# EAGLE design Panel (EAGLE 6.5.0)
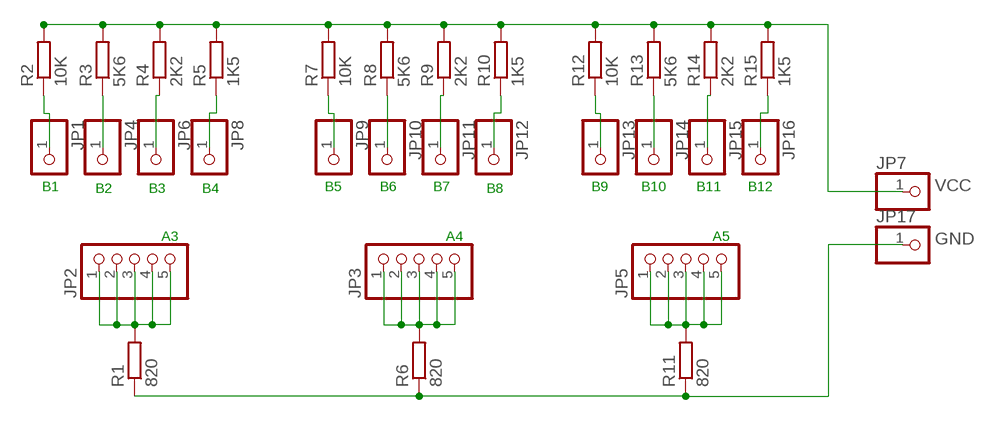
[diagram p0: schematic, sheet 1]

## Parts
JP1  PINHD-1X1  [1X01]
JP2  PINHD-1X5  [1X05]
JP3  PINHD-1X5  [1X05]
JP4  PINHD-1X1  [1X01]
JP5  PINHD-1X5  [1X05]
JP6  PINHD-1X1  [1X01]
JP7  PINHD-1X1  [1X01]
JP8  PINHD-1X1  [1X01]
JP9  PINHD-1X1  [1X01]
JP10  PINHD-1X1  [1X01]
JP11  PINHD-1X1  [1X01]
JP12  PINHD-1X1  [1X01]
JP13  PINHD-1X1  [1X01]
JP14  PINHD-1X1  [1X01]
JP15  PINHD-1X1  [1X01]
JP16  PINHD-1X1  [1X01]
JP17  PINHD-1X1  [1X01]
R1  820  R-EU_0207/12  [0207/12]
R2  10K  R-EU_0207/12  [0207/12]
R3  5K6  R-EU_0207/12  [0207/12]
R4  2K2  R-EU_0207/12  [0207/12]
R5  1K5  R-EU_0207/12  [0207/12]
R6  820  R-EU_0207/12  [0207/12]
R7  10K  R-EU_0207/12  [0207/12]
R8  5K6  R-EU_0207/12  [0207/12]
R9  2K2  R-EU_0207/12  [0207/12]
R10  1K5  R-EU_0207/12  [0207/12]
R11  820  R-EU_0207/12  [0207/12]
R12  10K  R-EU_0207/12  [0207/12]
R13  5K6  R-EU_0207/12  [0207/12]
R14  2K2  R-EU_0207/12  [0207/12]
R15  1K5  R-EU_0207/12  [0207/12]

## Nets
A1: JP3.1 JP3.2 JP3.3 JP3.4 JP3.5 R6.2
A2: JP5.1 JP5.2 JP5.3 JP5.4 JP5.5 R11.2
A3: JP2.1 JP2.2 JP2.3 JP2.4 JP2.5 R1.2
B1: JP1.1 R2.1
B2: JP4.1 R3.1
B3: JP6.1 R4.1
B4: JP8.1 R5.1
B5: JP9.1 R7.1
B6: JP10.1 R8.1
B7: JP11.1 R9.1
B8: JP12.1 R10.1
B9: JP13.1 R12.1
B10: JP14.1 R13.1
B11: JP15.1 R14.1
B12: JP16.1 R15.1
GND: JP17.1 R1.1 R6.1 R11.1
VCC: JP7.1 R2.2 R3.2 R4.2 R5.2 R7.2 R8.2 R9.2 R10.2 R12.2 R13.2 R14.2 R15.2

## Notes on the sheet
- B1 | B2 | B3 | B4 | B5 | B6 | B7 | B8 | B9 | B10 | B11 | B12
- A3 | A4 | A5

## Library data of the parts
JP1 JP4 JP6-JP17 = pinhead:PINHD-1X1: PIN HEADER
JP2 JP3 JP5 = pinhead:PINHD-1X5: PIN HEADER
R1-R15 = resistor:R-EU_: RESISTOR, European symbol

## Net classes
0 default: width 0.254 mm, drill 0.254 mm, clearance 0.305 mm

## Board
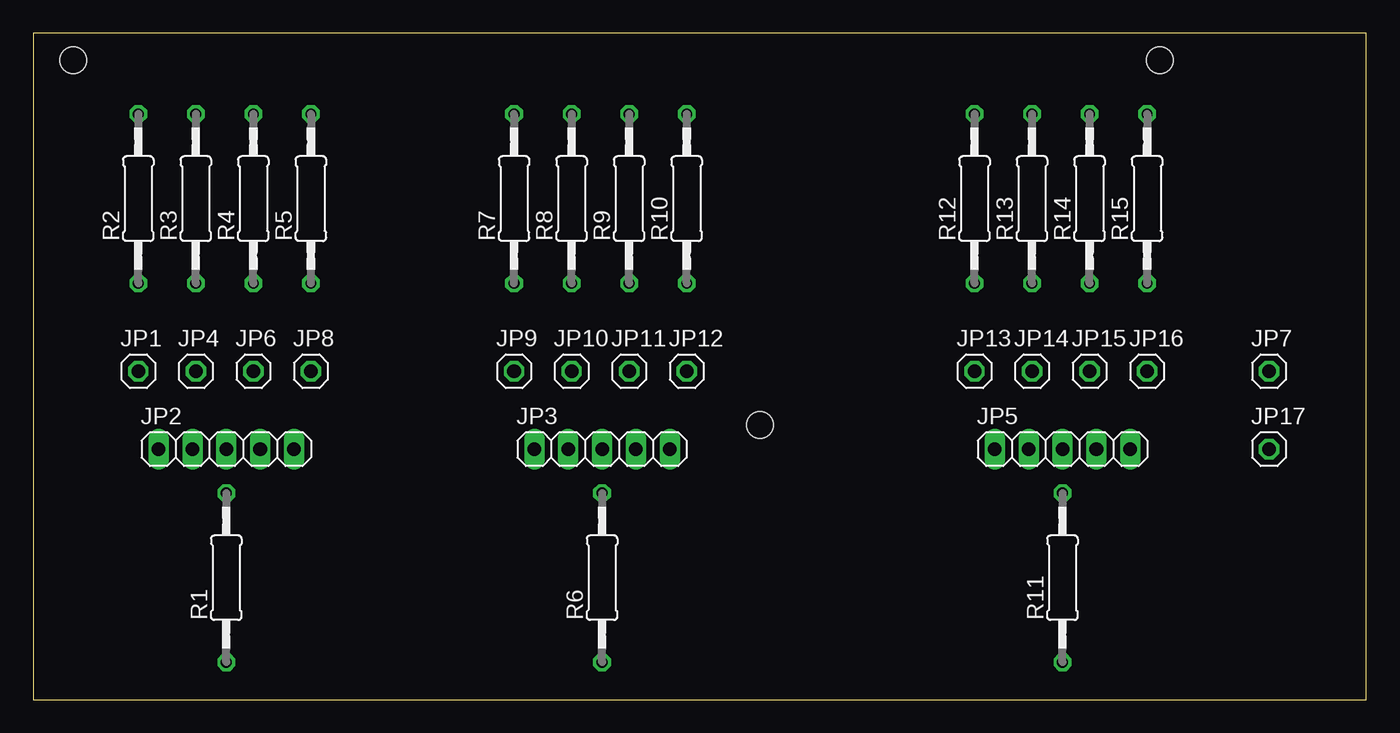
[diagram p1: board, top side]
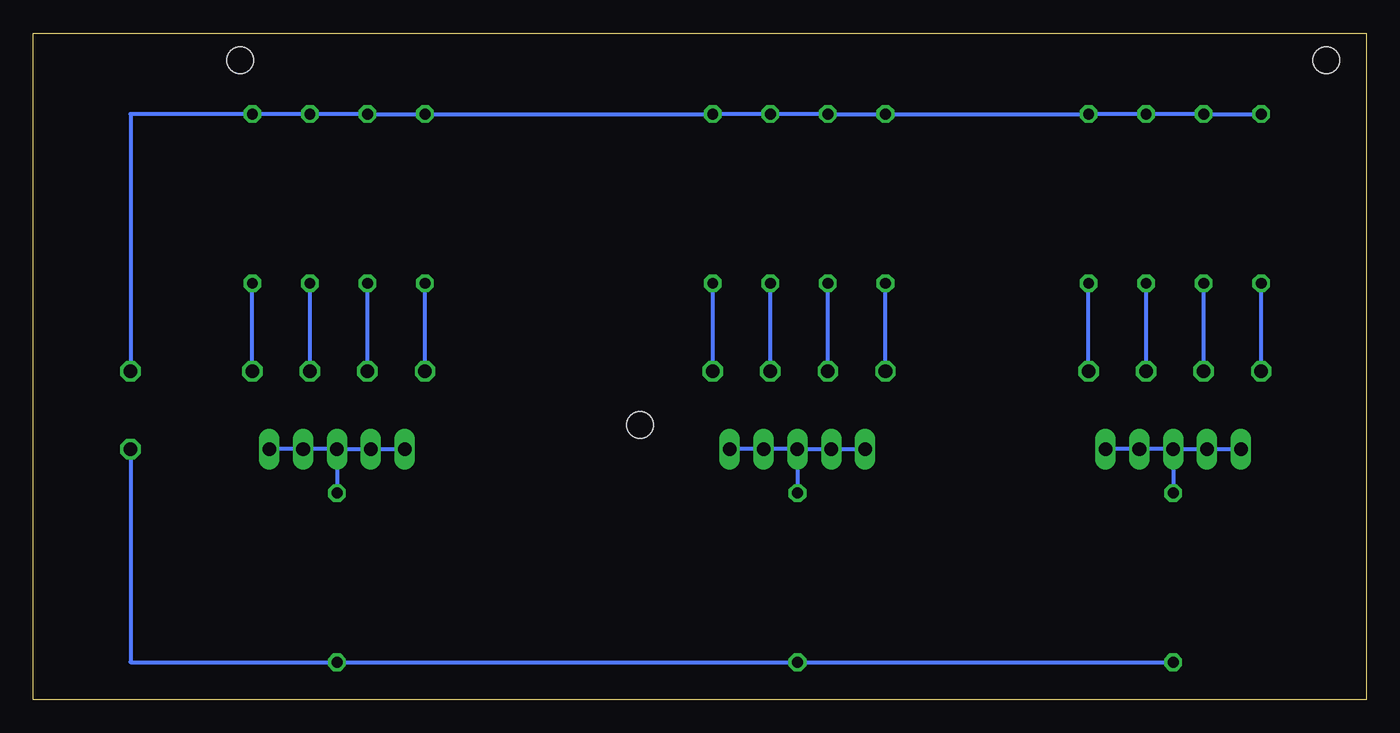
[diagram p2: board, bottom side, seen from below]

Size 100 x 50 mm. Coordinates in mm from the lower left corner, seen from the top.
Outline: 0,0 100,0 100,50 0,50 0,0
Copper layers (1*16): Top 0.035mm / dielectric 1.5mm / Bottom 0.035mm
Design rules "default": minimum track width 12mil, minimum drill 24mil, track to track 10mil, track to pad 12mil, pad to pad 10mil, via to via 8mil, smd to smd 8mil, copper to edge 40mil, drill to drill 8mil, minimum pad ring 10mil, minimum via ring 8mil, stop-mask expansion 4mil, vias tented up to drill 0mil, thermal gap 10mil
Holes 2 mm at 3,48 84.5,48 54.5,20.6

### Footprints (pad centres in the part's own frame; a part is rotated, then mirrored left to right if it is on the bottom)
1X01 = drill 1.016 octagon: 1 0,0
1X05 = drill 1.016 long: 1 -5.08,0; 2 -2.54,0; 3 0,0; 4 2.54,0; 5 5.08,0
0207/12 = drill 0.813 octagon: 1 -6.35,0; 2 6.35,0

### Placement (x,y rotation side)
JP1  7.87,24.64 0 top
JP2  14.48,18.8 0 top
JP3  42.67,18.8 0 top
JP4  12.19,24.64 0 top
JP5  77.22,18.8 0 top
JP6  16.51,24.64 0 top
JP7  92.71,24.64 0 top
JP8  20.83,24.64 0 top
JP9  36.07,24.64 0 top
JP10  40.39,24.64 0 top
JP11  44.7,24.64 0 top
JP12  49.02,24.64 0 top
JP13  70.61,24.64 0 top
JP14  74.93,24.64 0 top
JP15  79.25,24.64 0 top
JP16  83.57,24.64 0 top
JP17  92.71,18.8 0 top
R1  14.48,9.14 90 top
R2  7.87,37.59 90 top
R3  12.19,37.59 90 top
R4  16.51,37.59 90 top
R5  20.83,37.59 90 top
R6  42.67,9.14 90 top
R7  36.07,37.59 90 top
R8  40.39,37.59 90 top
R9  44.7,37.59 90 top
R10  49.02,37.59 90 top
R11  77.22,9.14 90 top
R12  70.61,37.59 90 top
R13  74.93,37.59 90 top
R14  79.25,37.59 90 top
R15  83.57,37.59 90 top

### Tracks (layer width: path | path; a pad name or v marks a point on that pad's centre or on a via)
A1
  Bottom 0.305: JP3.1 JP3.2 JP3.3 | JP3.3 R6.2 | JP3.3 JP3.4 JP3.5
A2
  Bottom 0.305: JP5.1 JP5.2 JP5.3 | JP5.3 R11.2 | JP5.3 JP5.4 JP5.5
A3
  Bottom 0.305: JP2.1 JP2.2 JP2.3 | JP2.3 R1.2 | JP2.3 JP2.4 JP2.5
B1
  Bottom 0.305: JP1.1 R2.1
B2
  Bottom 0.305: JP4.1 R3.1
B3
  Bottom 0.305: JP6.1 R4.1
B4
  Bottom 0.305: JP8.1 R5.1
B5
  Bottom 0.305: JP9.1 R7.1
B6
  Bottom 0.305: JP10.1 R8.1
B7
  Bottom 0.305: JP11.1 R9.1
B8
  Bottom 0.305: JP12.1 R10.1
B9
  Bottom 0.305: JP13.1 R12.1
B10
  Bottom 0.305: JP14.1 R13.1
B11
  Bottom 0.305: JP15.1 R14.1
B12
  Bottom 0.305: JP16.1 R15.1
GND
  Bottom 0.305: R1.1 R6.1 R11.1 92.71,2.79 JP17.1
VCC
  Bottom 0.305: R2.2 R3.2 R4.2 R5.2 R7.2 R8.2 R9.2 R10.2 R12.2 R13.2 R14.2 R15.2 92.71,43.94 JP7.1
(copper drawn outside any net)
  shapes: Bottom area x1